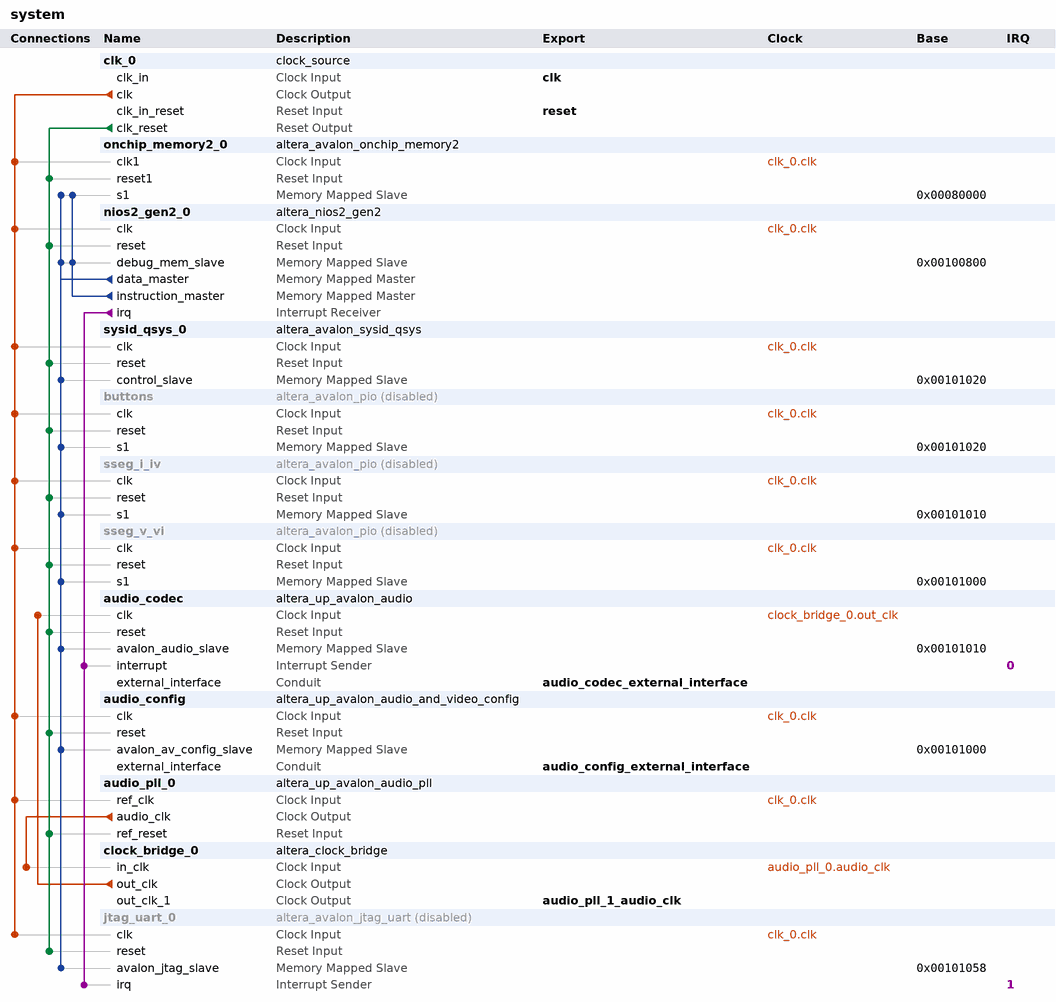
[diagram p0: system contents]
# Platform Designer (Qsys) system system, Cyclone V 5CGXFC5C6F27C7
# Parameters at their usual value, and those the tool derives, are not listed.
package require -exact qsys 17.1
create_system system
set_project_property DEVICE_FAMILY {Cyclone V}
set_project_property DEVICE 5CGXFC5C6F27C7

add_instance clk_0 clock_source 17.1
set_instance_parameter_value clk_0 clockFrequency 100000000

add_instance onchip_memory2_0 altera_avalon_onchip_memory2 17.1
set_instance_parameter_value onchip_memory2_0 dataWidth 32
set_instance_parameter_value onchip_memory2_0 dualPort false
set_instance_parameter_value onchip_memory2_0 initMemContent true
set_instance_parameter_value onchip_memory2_0 initializationFileName onchip_mem.hex
set_instance_parameter_value onchip_memory2_0 memorySize 442000

add_instance nios2_gen2_0 altera_nios2_gen2 17.1
set_instance_parameter_value nios2_gen2_0 dcache_size 2048
set_instance_parameter_value nios2_gen2_0 exceptionSlave onchip_memory2_0.s1
set_instance_parameter_value nios2_gen2_0 icache_size 4096
set_instance_parameter_value nios2_gen2_0 impl Tiny
set_instance_parameter_value nios2_gen2_0 resetSlave onchip_memory2_0.s1

add_instance sysid_qsys_0 altera_avalon_sysid_qsys 17.1
set_instance_parameter_value sysid_qsys_0 id 1

add_instance buttons altera_avalon_pio 17.1
set_instance_property buttons ENABLED false
set_instance_parameter_value buttons bitClearingEdgeCapReg true
set_instance_parameter_value buttons captureEdge true
set_instance_parameter_value buttons direction Input
set_instance_parameter_value buttons edgeType FALLING
set_instance_parameter_value buttons width 4

add_instance sseg_i_iv altera_avalon_pio 17.1
set_instance_property sseg_i_iv ENABLED false
set_instance_parameter_value sseg_i_iv direction Output
set_instance_parameter_value sseg_i_iv width 32

add_instance sseg_v_vi altera_avalon_pio 17.1
set_instance_property sseg_v_vi ENABLED false
set_instance_parameter_value sseg_v_vi direction Output
set_instance_parameter_value sseg_v_vi width 32

add_instance audio_codec altera_up_avalon_audio 17.1
set_instance_parameter_value audio_codec audio_in true
set_instance_parameter_value audio_codec avalon_bus_type {Memory Mapped}
set_instance_parameter_value audio_codec dw 16

add_instance audio_config altera_up_avalon_audio_and_video_config 17.1
set_instance_parameter_value audio_config audio_in {Line In to ADC}
set_instance_parameter_value audio_config bit_length 16
set_instance_parameter_value audio_config board DE1-SoC
set_instance_parameter_value audio_config dac_enable false
set_instance_parameter_value audio_config line_in_bypass true
set_instance_parameter_value audio_config sampling_rate {32 kHz}

add_instance audio_pll_0 altera_up_avalon_audio_pll 17.1
set_instance_parameter_value audio_pll_0 gui_refclk 100.0

add_instance clock_bridge_0 altera_clock_bridge 17.1
set_instance_parameter_value clock_bridge_0 DERIVED_CLOCK_RATE 12288135
set_instance_parameter_value clock_bridge_0 EXPLICIT_CLOCK_RATE 0
set_instance_parameter_value clock_bridge_0 NUM_CLOCK_OUTPUTS 2

add_instance jtag_uart_0 altera_avalon_jtag_uart 17.1
set_instance_property jtag_uart_0 ENABLED false
set_instance_parameter_value jtag_uart_0 simInteractiveOptions NO_INTERACTIVE_WINDOWS

# connections
add_connection audio_pll_0.audio_clk clock_bridge_0.in_clk clock
add_connection clk_0.clk audio_config.clk clock
add_connection clk_0.clk audio_pll_0.ref_clk clock
add_connection clk_0.clk buttons.clk clock
add_connection clk_0.clk jtag_uart_0.clk clock
add_connection clk_0.clk nios2_gen2_0.clk clock
add_connection clk_0.clk onchip_memory2_0.clk1 clock
add_connection clk_0.clk sseg_i_iv.clk clock
add_connection clk_0.clk sseg_v_vi.clk clock
add_connection clk_0.clk sysid_qsys_0.clk clock
add_connection clock_bridge_0.out_clk audio_codec.clk clock
add_connection clk_0.clk_reset audio_codec.reset reset
add_connection clk_0.clk_reset audio_config.reset reset
add_connection clk_0.clk_reset audio_pll_0.ref_reset reset
add_connection clk_0.clk_reset buttons.reset reset
add_connection clk_0.clk_reset jtag_uart_0.reset reset
add_connection clk_0.clk_reset nios2_gen2_0.reset reset
add_connection clk_0.clk_reset onchip_memory2_0.reset1 reset
add_connection clk_0.clk_reset sseg_i_iv.reset reset
add_connection clk_0.clk_reset sseg_v_vi.reset reset
add_connection clk_0.clk_reset sysid_qsys_0.reset reset
add_connection nios2_gen2_0.data_master audio_codec.avalon_audio_slave avalon
set_connection_parameter_value nios2_gen2_0.data_master/audio_codec.avalon_audio_slave baseAddress 0x00101010
add_connection nios2_gen2_0.data_master audio_config.avalon_av_config_slave avalon
set_connection_parameter_value nios2_gen2_0.data_master/audio_config.avalon_av_config_slave baseAddress 0x00101000
add_connection nios2_gen2_0.data_master buttons.s1 avalon
set_connection_parameter_value nios2_gen2_0.data_master/buttons.s1 baseAddress 0x00101020
add_connection nios2_gen2_0.data_master jtag_uart_0.avalon_jtag_slave avalon
set_connection_parameter_value nios2_gen2_0.data_master/jtag_uart_0.avalon_jtag_slave baseAddress 0x00101058
add_connection nios2_gen2_0.data_master nios2_gen2_0.debug_mem_slave avalon
set_connection_parameter_value nios2_gen2_0.data_master/nios2_gen2_0.debug_mem_slave baseAddress 0x00100800
add_connection nios2_gen2_0.data_master onchip_memory2_0.s1 avalon
set_connection_parameter_value nios2_gen2_0.data_master/onchip_memory2_0.s1 baseAddress 0x00080000
add_connection nios2_gen2_0.data_master sseg_i_iv.s1 avalon
set_connection_parameter_value nios2_gen2_0.data_master/sseg_i_iv.s1 baseAddress 0x00101010
add_connection nios2_gen2_0.data_master sseg_v_vi.s1 avalon
set_connection_parameter_value nios2_gen2_0.data_master/sseg_v_vi.s1 baseAddress 0x00101000
add_connection nios2_gen2_0.data_master sysid_qsys_0.control_slave avalon
set_connection_parameter_value nios2_gen2_0.data_master/sysid_qsys_0.control_slave baseAddress 0x00101020
add_connection nios2_gen2_0.instruction_master nios2_gen2_0.debug_mem_slave avalon
set_connection_parameter_value nios2_gen2_0.instruction_master/nios2_gen2_0.debug_mem_slave baseAddress 0x00100800
add_connection nios2_gen2_0.instruction_master onchip_memory2_0.s1 avalon
set_connection_parameter_value nios2_gen2_0.instruction_master/onchip_memory2_0.s1 baseAddress 0x00080000
add_connection nios2_gen2_0.irq audio_codec.interrupt interrupt
set_connection_parameter_value nios2_gen2_0.irq/audio_codec.interrupt irqNumber 0
add_connection nios2_gen2_0.irq jtag_uart_0.irq interrupt
set_connection_parameter_value nios2_gen2_0.irq/jtag_uart_0.irq irqNumber 1

# exported interfaces
add_interface audio_codec_external_interface conduit end
set_interface_property audio_codec_external_interface EXPORT_OF audio_codec.external_interface
add_interface audio_config_external_interface conduit end
set_interface_property audio_config_external_interface EXPORT_OF audio_config.external_interface
add_interface audio_pll_1_audio_clk clock source
set_interface_property audio_pll_1_audio_clk EXPORT_OF clock_bridge_0.out_clk_1
add_interface clk clock sink
set_interface_property clk EXPORT_OF clk_0.clk_in
add_interface reset reset sink
set_interface_property reset EXPORT_OF clk_0.clk_in_reset

set_interconnect_requirement {$system} qsys_mm.clockCrossingAdapter HANDSHAKE
set_interconnect_requirement {$system} qsys_mm.enableEccProtection FALSE
set_interconnect_requirement {$system} qsys_mm.insertDefaultSlave FALSE
set_interconnect_requirement {$system} qsys_mm.maxAdditionalLatency 1

save_system system.qsys
